# Altium schematic sheet memory.SchDoc
size A; SheetNumber: 10; SheetTotal: 10
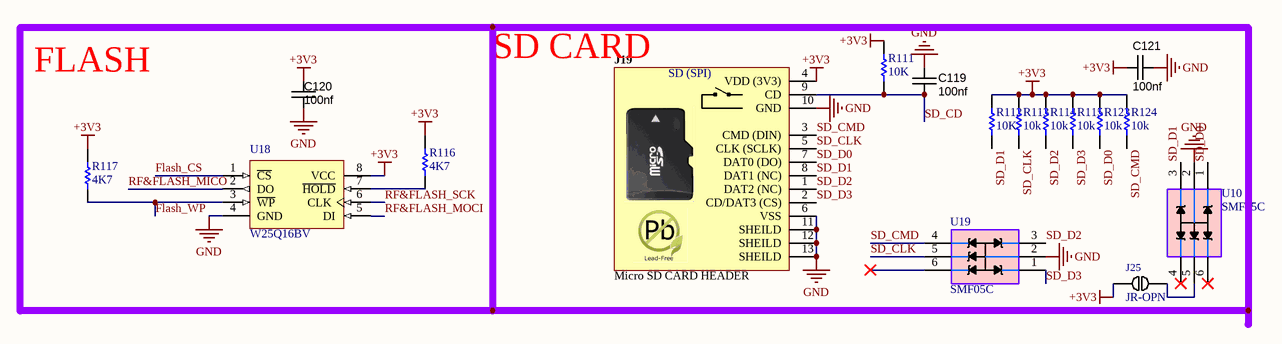
[diagram p0: memory.SchDoc]

## Parts
C119  100nf  [CAPC1608X90N]
C120  100nf  [CAPC1608X90N]
C121  100nf  [CAPC1608X90N]
J19  Micro SD CARD HEADER  [SMD_CON_Micro SD -Push-Push]
J25  JR-OPN
R111  10K  [Resistor_SMD_0603 (1608)]
R112  10K  [Resistor_SMD_0603 (1608)]
R113  10k  [Resistor_SMD_0603 (1608)]
R114  10k  [Resistor_SMD_0603 (1608)]
R115  10k  [Resistor_SMD_0603 (1608)]
R116  4K7  [Resistor_SMD_0603 (1608)]
R117  4K7  [Resistor_SMD_0603 (1608)]
R123  10k  [Resistor_SMD_0603 (1608)]
R124  10k  [Resistor_SMD_0603 (1608)]
U10  SMF05C  [SC706]
U18  W25Q16BV  [SO08]
U19  SMF05C  [SC706]

## Nets
+3V3: C120.2 C121.2 J19.4(VDD_(3V3)) J25.2 R111.1 R112.1 R113.1 R114.1 R115.1 R116.1 R117.1 R123.1 R124.1 U18.8(VCC)
GND: C119.1 C120.1 C121.1 J19.6(VSS) J19.10(GND) J19.11(SHEILD) J19.12(SHEILD) J19.13(SHEILD) U10.2(Gnd) U18.4(GND) U19.2(Gnd)
Flash_CS: U18.1(~{CS})
Flash_WP: R117.2 U18.3(~{WP})
RF&FLASH_MICO: U18.2(DO)
RF&FLASH_MOCI: U18.5(DI)
RF&FLASH_SCK: U18.6(CLK)
SD_CD: C119.2 J19.9(CD) R111.2
SD_CLK: J19.5(CLK_(SCLK)) R113.2 U19.5(L5)
SD_CMD: J19.3(CMD_(DIN)) R124.2 U19.4(L4)
SD_D0: J19.7(DAT0_(DO)) R123.2 U10.1(L1)
SD_D1: J19.8(DAT1_(NC)) R112.2 U10.3(L3)
SD_D2: J19.1(DAT2_(NC)) R114.2 U19.3(L3)
SD_D3: J19.2(CD/DAT3_(CS)) R115.2 U19.1(L1)
NetJ25_1: J25.1 U10.5(L5)
NetR116_2: R116.2 U18.7(~{HOLD})

Not connected (* = marked no-connect by the designer): U10 4(L4)* 6(L6)*; U19 6(L6)*

## Notes on the sheet
- FLASH
- SD CARD
- (in symbol CON_Micro SD) SD (SPI)

## Library data of the parts
C119-C121 = CAPC_100n_0603_X7R_50V_10%: Capacitor SMD Cer 100nF 10% 50V X7R 0603; Manufacturer 1: AVX Corporation; Manufacturer Part Number 1: 06035C104KAT2A; Ratings: 50V; X7R; Material: ceramic; SCDType: spec; Value: 100n; Manufacturer 2: TDK Corporation; Manufacturer Part Number 2: C1608X7R1H104K; Package / Case: 0603 (1608 Metric); Tolerance: ±10%; Supplier 1: Digi-Key; Supplier Part Number 1: 478-5052-1-ND; ComponentLink1URL: http://www.avx.com/docs/Catalogs/cx7r.pdf; ComponentLink1Description: http://www.avx.com/docs/Catalogs/cx7r.pdf; Supplier 2: Digi-Key; Supplier Part Number 2: 445-1314-1-ND; ComponentLink2URL: http://product.tdk.com/capacitor/mlcc/en/documents/mlcc_commercial_general_en.pdf; ComponentLink2Description: http://product.tdk.com/capacitor/mlcc/en/documents/mlcc_commercial_general_en.pdf
J19 = CON_Micro SD: Secure Digital Card Socket; Max Current: mA; designer: Eng. Saeid Jorablo; Company: SJ Libraries; Connector type: Header; Mounting Technology: Surface Mount; Status: Unreleased; Category: Connector; Pin Count: 13; Publisher: SJ UnLimited; ComponentLink1Description: Datasheet; ComponentLink2Description: Reference; Update: 7/8/2012; HelpURL: http://s3.picofile.com/file/7443264187/Coming_Soon_logo.gif
J25 = BYPASS: SOLDERDOT BYPASS; Manufacturer Part Number 1: Board Feature; Reel: Open; Supplier 1: Solder-it-yourself; Manufacturer 1: Board feature
R111-R115 R123 R124 = Resistor: Resistor 0603; Email: razi.vesali@gmail.com; Published: 17-Jun-2016; LatestRevisionNote: Re-released for puplic; Publisher: Seyed Razi Vesali; Value: 10k
R116 R117 = Resistor: Resistor 0603; Email: razi.vesali@gmail.com; Value: 10k; Published: 17-Jun-2016; LatestRevisionNote: Re-released for puplic; Publisher: Seyed Razi Vesali
U10 U19 = TVS Diode: TVS Diode Array  For ESD and Latch-Up Protection
U18 = W25Q16BV: Flash, pin, soic, flash, Memory, Semiconductors and Actives, serial, ic; ComponentLink1Description: Website: Tarahiboard; ComponentLink1URL: https://www.tarahiboard.com/; DatasheetVersion: 2022